# Altium schematic sheet driverpower.SchDoc
size A1
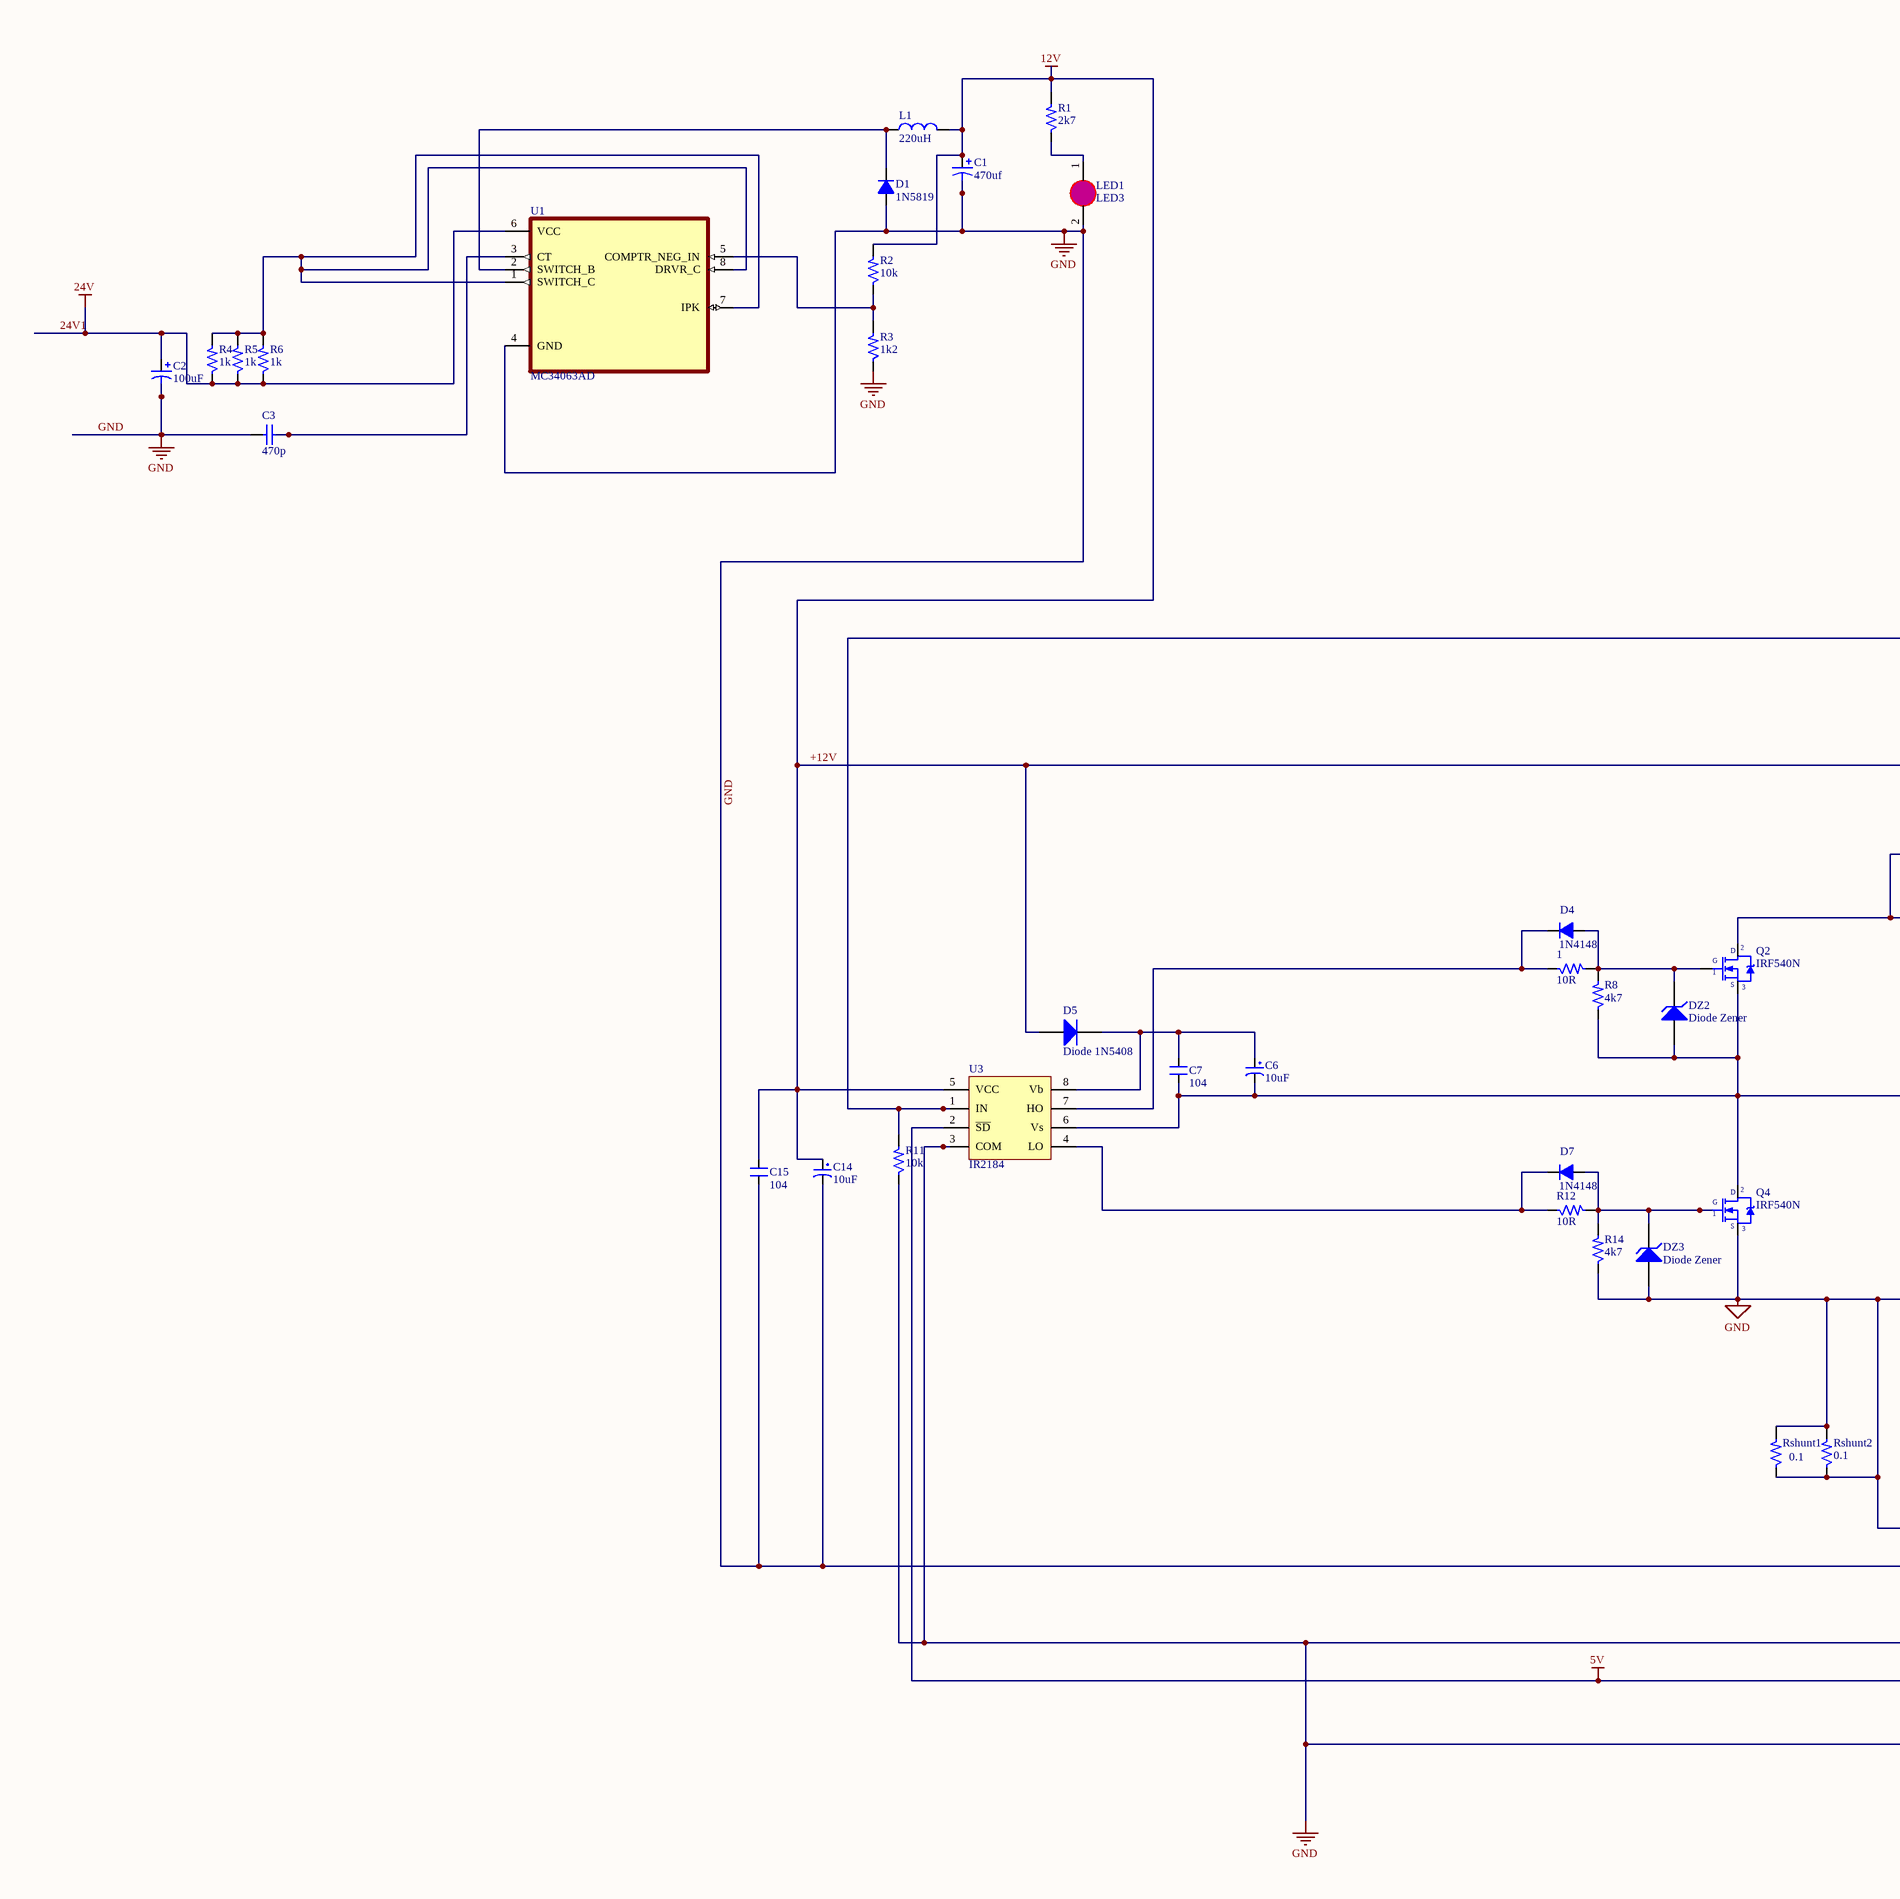
[diagram p0: driverpower.SchDoc, left]
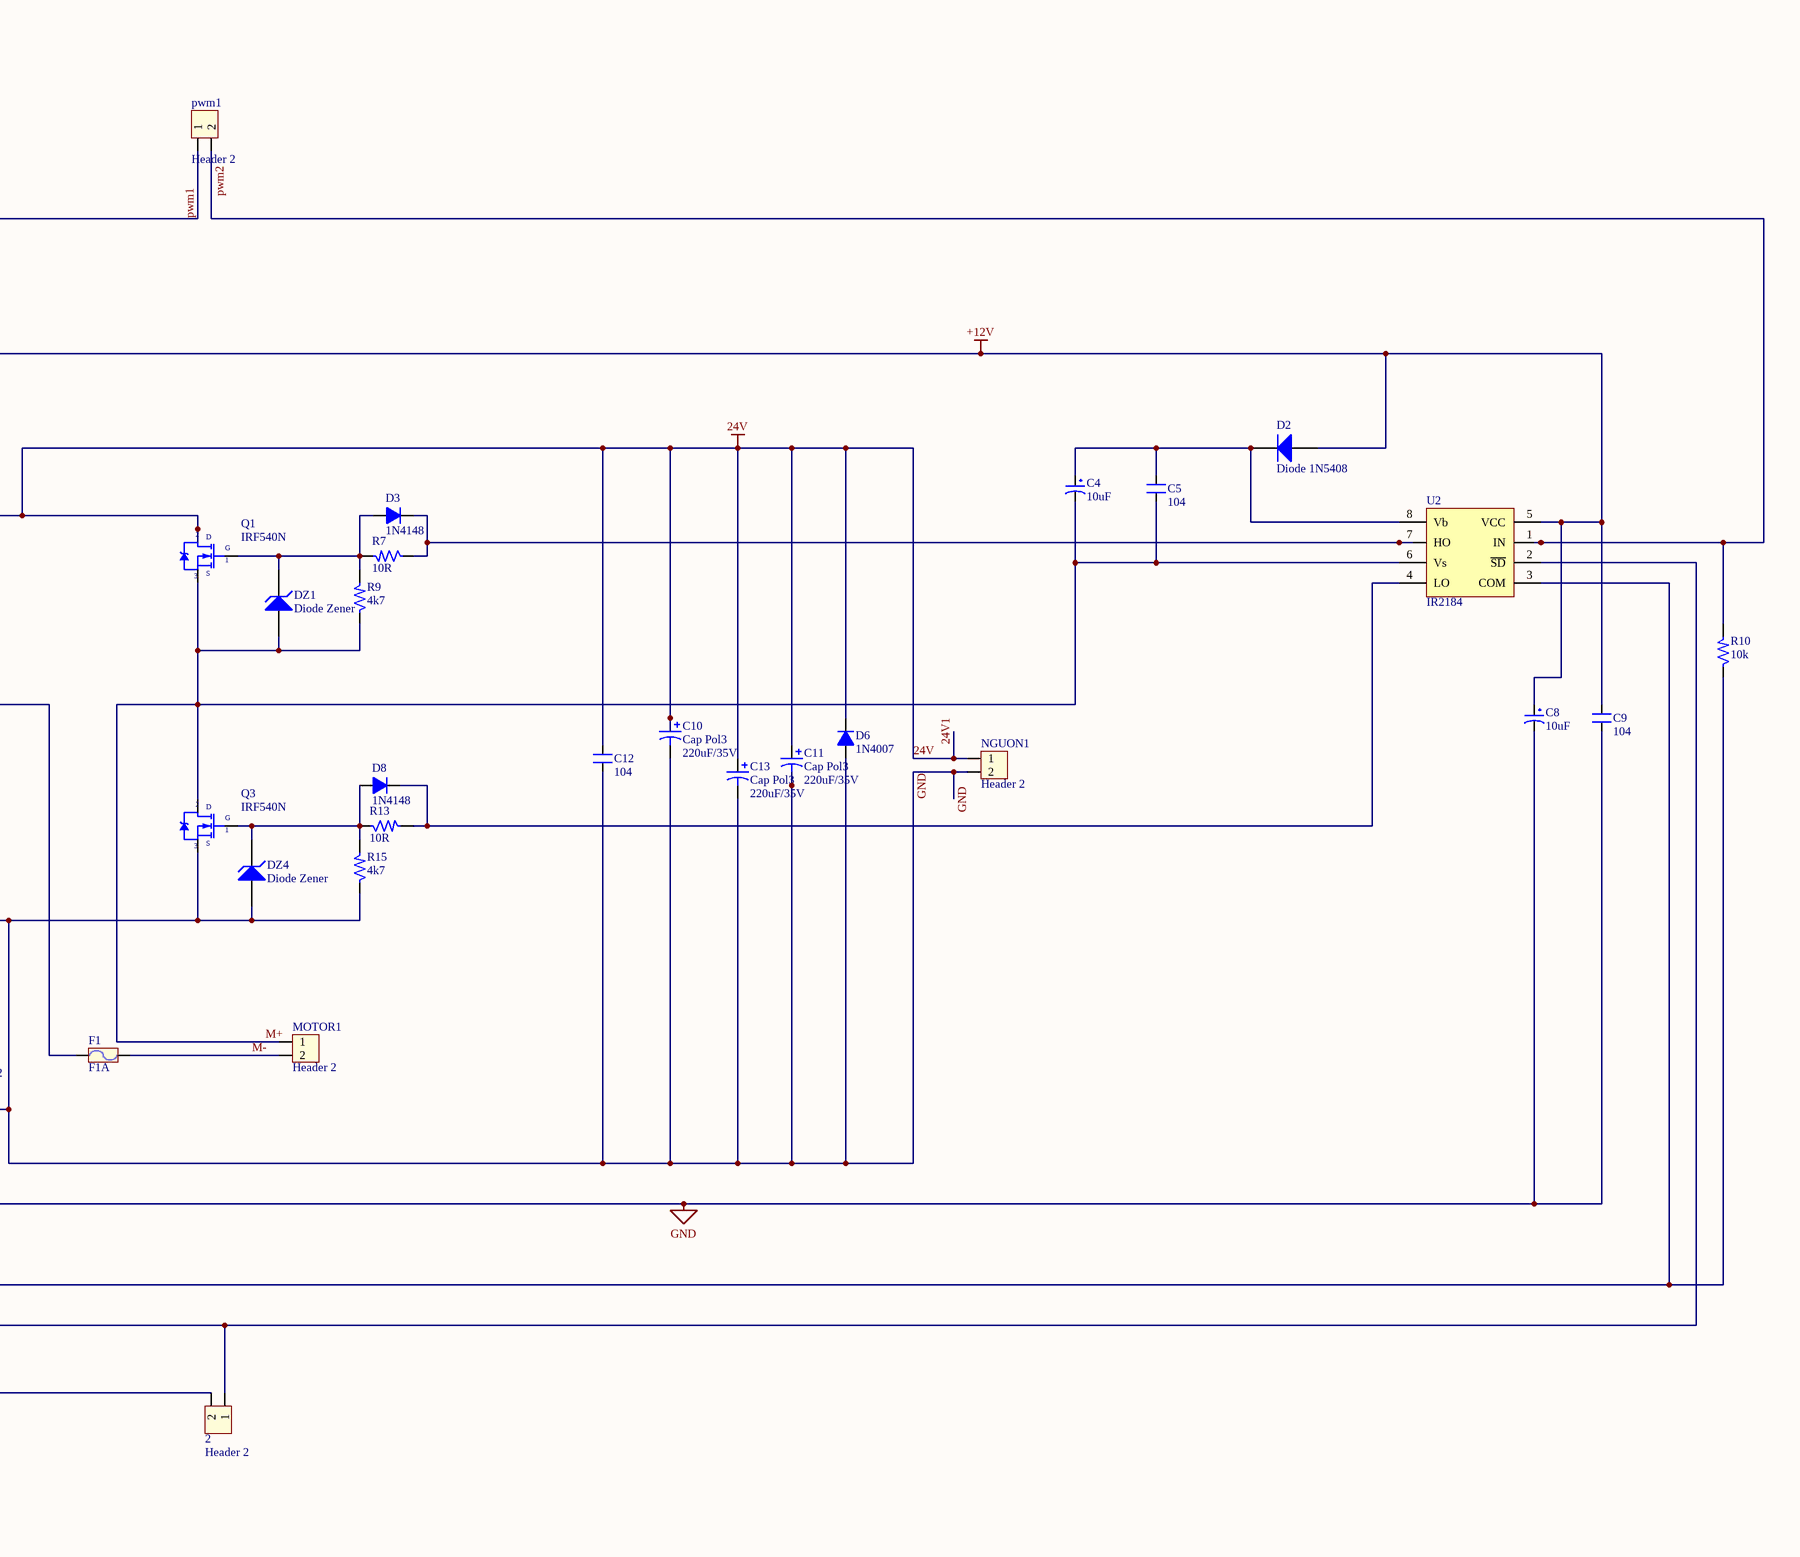
[diagram p1: driverpower.SchDoc, right]

## Parts
1  10R  [SM-1206]
2  Header 2  [HED2]
C1  470uf  [C3MM]
C2  100uF  [C3MM]
C3  470p  [C1206]
C4  10uF  [CP1/2]
C5  104  [SM-0805]
C6  10uF  [CP1/2]
C7  104  [SM-0805]
C8  10uF  [CP1/2]
C9  104  [SM-0805]
C10  Cap Pol3  value 220uF/35V  [CP2/5]
C11  Cap Pol3  value 220uF/35V  [CP2/5]
C12  104  [SM-0805]
C13  Cap Pol3  value 220uF/35V  [CP2/5]
C14  10uF  [CP1/2]
C15  104  [SM-0805]
D1  1N5819  [D5A]
D2  Diode 1N5408  [DO-201AD]
D3  1N4148  [D1A]
D4  1N4148  [D1A]
D5  Diode 1N5408  [DO-201AD]
D6  1N4007  [D1A]
D7  1N4148  [D1A]
D8  1N4148  [D1A]
DZ1  Diode Zener  [DIODE/NOM/0.5A]
DZ2  Diode Zener  [DIODE/NOM/0.5A]
DZ3  Diode Zener  [DIODE/NOM/0.5A]
DZ4  Diode Zener  [DIODE/NOM/0.5A]
F1  F1A  [Fuse]
L1  220uH  [L/0.4]
LED1  LED3  [LED0805]
MOTOR1  Header 2  [HED2]
NGUON1  Header 2  [HED2]
pwm1  Header 2  [HED2]
Q1  IRF540N  [QTO-220]
Q2  IRF540N  [QTO-220]
Q3  IRF540N  [QTO-220]
Q4  IRF540N  [QTO-220]
R1  2k7  [SM-1206]
R2  10k  [SM-1206]
R3  1k2  [SM-1206]
R4  1k  [SM-1206]
R5  1k  [SM-1206]
R6  1k  [SM-1206]
R7  10R  [SM-1206]
R8  4k7  [SM-1206]
R9  4k7  [SM-1206]
R10  10k  [SM-1206]
R11  10k  [SM-1206]
R12  10R  [SM-1206]
R13  10R  [SM-1206]
R14  4k7  [SM-1206]
R15  4k7  [SM-1206]
Rshunt1  0.1  [SM-1206]
Rshunt2  0.1  [SM-1206]
U1  MC34063AD  [SOIC127P599X175-8N]
U2  IR2184  [SOIC127P490X600X175-8N]
U3  IR2184  [SOIC127P490X600X175-8N]

## Nets
5V: 2.1 U2.2(~{SD}) U3.2(~{SD})
24V: C2.1 C10.1 C11.1 C12.2 C13.1 D6.2(K) NGUON1.1 Q1.2(D) Q2.2(D) R4.1 R5.1 R6.1 U1.6(VCC)  [also labelled 24V1]
+12V: C1.1 C8.1 C9.2 C14.1 C15.2 D2.1(A) D5.1(A) L1.2 R1.2 R2.2 U2.5(VCC) U3.5(VCC)  [also labelled 12V]
GND: 2.2 C1.2 C2.2 C3.1 C8.2 C9.1 C10.2 C11.2 C12.1 C13.2 C14.2 C15.1 D1.1(A) D6.1(A) DZ3.1(A) DZ4.1(A) LED1.2(K) NGUON1.2 Q3.3(S) Q4.3(S) R3.1 R10.1 R11.1 R14.1 R15.1 Rshunt1.1 Rshunt1.2 Rshunt2.1 Rshunt2.2 U1.4(GND) U2.3(COM) U3.3(COM)
M+: C4.2 C5.1 DZ1.1(A) MOTOR1.1 Q1.3(S) Q3.2(D) R9.1 U2.6(Vs)
M-: F1.2 MOTOR1.2
pwm1: pwm1.1 R11.2 U3.1(IN)
pwm2: pwm1.2 R10.2 U2.1(IN)
Net1_1: 1.1 D4.2(K) U3.7(HO)
Net1_2: 1.2 D4.1(A) DZ2.2(K) Q2.1(G) R8.2
NetC3_2: C3.2 U1.3(CT)
NetC4_1: C4.1 C5.2 D2.2(K) U2.8(Vb)
NetC6_1: C6.1 C7.2 D5.2(K) U3.8(Vb)
NetC6_2: C6.2 C7.1 DZ2.1(A) F1.1 Q2.3(S) Q4.2(D) R8.1 U3.6(Vs)
NetD1_2: D1.2(K) L1.1 U1.2(SWITCH_B)
NetD3_1: D3.1(A) DZ1.2(K) Q1.1(G) R7.2 R9.2
NetD3_2: D3.2(K) R7.1 U2.7(HO)
NetD7_1: D7.1(A) DZ3.2(K) Q4.1(G) R12.2 R14.2
NetD7_2: D7.2(K) R12.1 U3.4(LO)
NetD8_1: D8.1(A) DZ4.2(K) Q3.1(G) R13.1 R15.2
NetD8_2: D8.2(K) R13.2 U2.4(LO)
NetLED1_1: LED1.1(A) R1.1
NetR2_1: R2.1 R3.2 U1.5(COMPTR_NEG_IN)
NetR4_2: R4.2 R5.2 R6.2 U1.1(SWITCH_C) U1.7(IPK) U1.8(DRVR_C)

## Notes on the sheet
- Title
- Size:
- Date:
- File:
- A1
- Number:
- Time:
- Revision:
- Sheet
- of

## Library data of the parts
1 R1-R15 Rshunt1 Rshunt2 = R: Resistor 1/4W; Value: R1/4W - 1K
2 MOTOR1 NGUON1 pwm1 = Hed2: Header 2 (Green); Value: Header 2
C1 C2 = Cap Pol 3mm: Polarized Capacitor (Axial); Published: 8-Jun-2000; LatestRevisionDate: 17-Jul-2002; LatestRevisionNote: Re-released for DXP Platform.; PackageReference: POLAR0.8; Publisher: Altium Limited
C3 = Cap SMD 1206
C4 C6 C8 C14 = CP1: Cap P  0,1uF < 22uF , 16 - 50V; Value: 10uF/50V; Description 1: 10 => 220uF/6,3V/10V - 10uF => 100uF/16V; Description 2: 0,1uF => 33uF/50V - 10uF => 22uF/63V; Description 3: 0,47uF => 10uF/100V
C5 C7 C9 C12 C15 = CM: Cap SMD; Value: 103
C10 C11 C13 = Cap Pol3: Polarized Capacitor (Surface Mount); VALUE: C?; LatestRevisionDate: 17-Jul-2002; LatestRevisionNote: Re-released for DXP Platform.; PackageReference: C0805; Publisher: Altium Limited
D1 = D5A: Diode 5A; Value: 1N5408
D2 D5 = Diode 1N5408: 3 Amp Medium Power Silicon Rectifier Diode; Published: 8-Jun-2000; LatestRevisionDate: 17-Jul-2002; LatestRevisionNote: Re-released for DXP Platform.; DatasheetVersion: Aug-1984; PackageReference: DO-201AD; Publisher: Altium Limited; PackageDescription: Diode, Axial; Body 9.5 x 5.3 mm (LxDia. max), Lead Dia. 1.32 mm (max); ComponentLink1Description: Manufacturer Link; ComponentLink1URL: http://www.irf.com/
D3 D4 D7 D8 = D1A: Diode 1A; Value: 1N4007
D6 = D1A: Diode 1A; Value: 1N4007
DZ1-DZ4 = Diode Zener: Zener Diode; Published: 8-Jun-2000; LatestRevisionDate: 17-Jul-2002; LatestRevisionNote: Re-released for DXP Platform.; PackageReference: DIODE-0.7; Publisher: Altium Limited
F1 = Fuse: Designed by: VanDungEvn; Value: Fuse
L1 = L1: Inductor; Value: 150 mH
LED1 = LEDSMD: LED 3mm
Q1-Q4 = IRF840: MOSFET N - CHANNEL 500V - 0.75 - 8A - TO-220; Value: IRF840
U1 = MC34063AD: Buck, Boost Switching Regulator IC Positive or Negative Adjustable 1.25V 1 Output 1.5A (Switch) 8-SOIC (0.154, 3.90mm Width); MF: ON Semiconductor; Price: None; Value: *; Availability: Unavailable; DigiKey-Purchase-URL: https://snapeda.com/shop?store=DigiKey&id=653486; Mouser-Purchase-URL: https://snapeda.com/shop?store=Mouser&id=653486; SnapEDA_Link: https://www.snapeda.com/parts/MC34063AD/ON%20Semiconductor/view-part/653486/?ref=snap; MP: MC34063AD; Package: SOIC-8 ON Semiconductor
U2 U3 = IR2184: Half-Bridge Driver